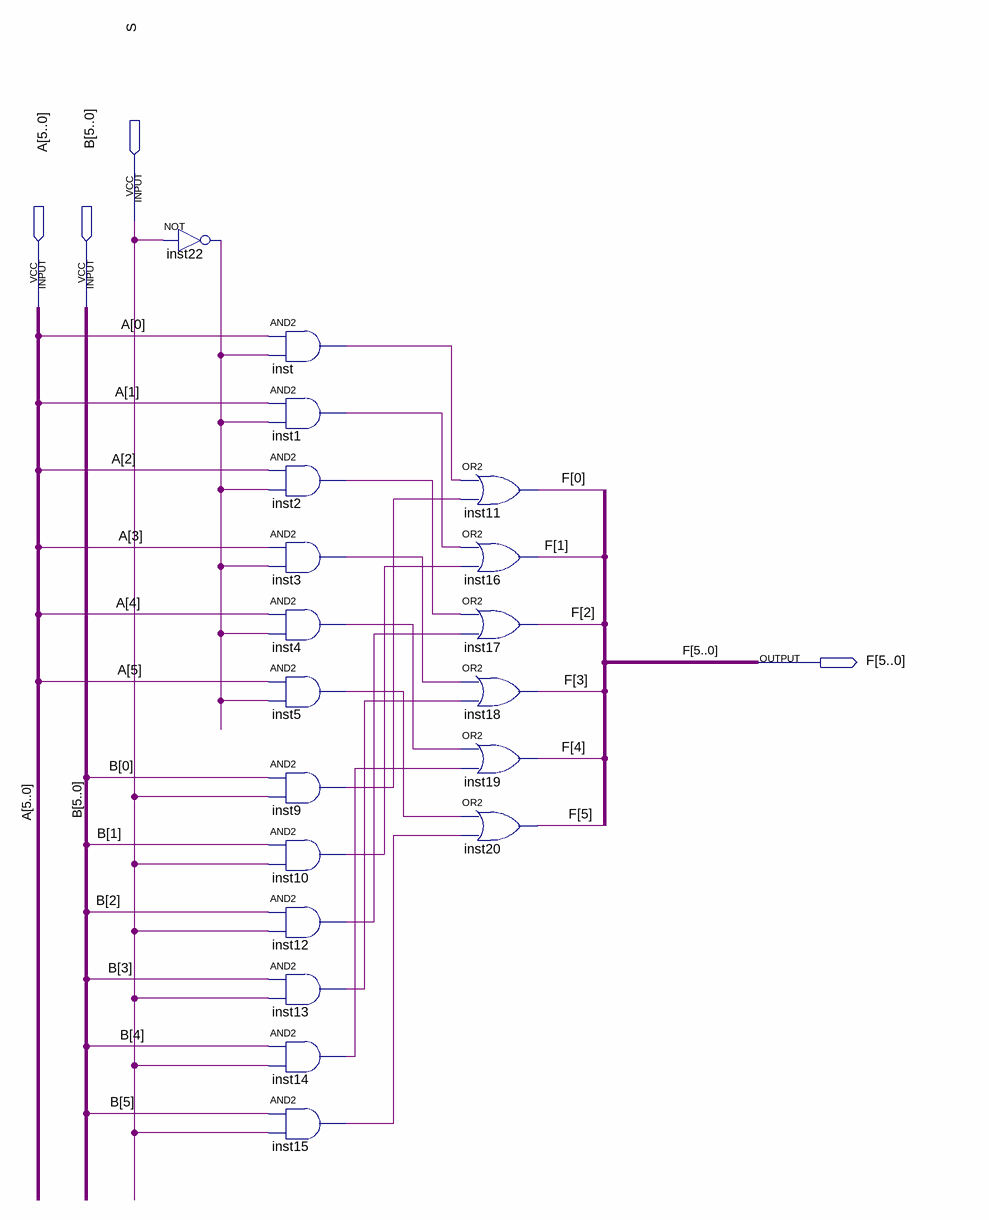
[diagram p0: schematic sheet]
// Quartus schematic MUX_2_1_6bits.bdf as structural Verilog: 19 symbols, 4 pins
module MUX_2_1_6bits (
  input  S,
  input  [5:0] A,
  input  [5:0] B,
  output [5:0] F
);

  wire inst1_out, inst2_out, inst3_out, inst4_out, inst5_out, inst9_out, inst10_out, inst12_out, inst13_out,
       inst14_out, inst15_out, inst22_out, inst_out;

  not inst22 (inst22_out, S);
  and inst (inst_out, A[0], inst22_out);
  and inst1 (inst1_out, A[1], inst22_out);
  and inst2 (inst2_out, A[2], inst22_out);
  and inst3 (inst3_out, A[3], inst22_out);
  and inst4 (inst4_out, A[4], inst22_out);
  and inst5 (inst5_out, A[5], inst22_out);
  and inst9 (inst9_out, B[0], S);
  and inst10 (inst10_out, B[1], S);
  and inst12 (inst12_out, B[2], S);
  and inst13 (inst13_out, B[3], S);
  and inst14 (inst14_out, B[4], S);
  and inst15 (inst15_out, B[5], S);
  or inst11 (F[0], inst_out, inst9_out);
  or inst16 (F[1], inst1_out, inst10_out);
  or inst17 (F[2], inst2_out, inst12_out);
  or inst18 (F[3], inst3_out, inst13_out);
  or inst19 (F[4], inst4_out, inst14_out);
  or inst20 (F[5], inst5_out, inst15_out);
endmodule
